# Altium project bgm111-breakout.PrjPcb
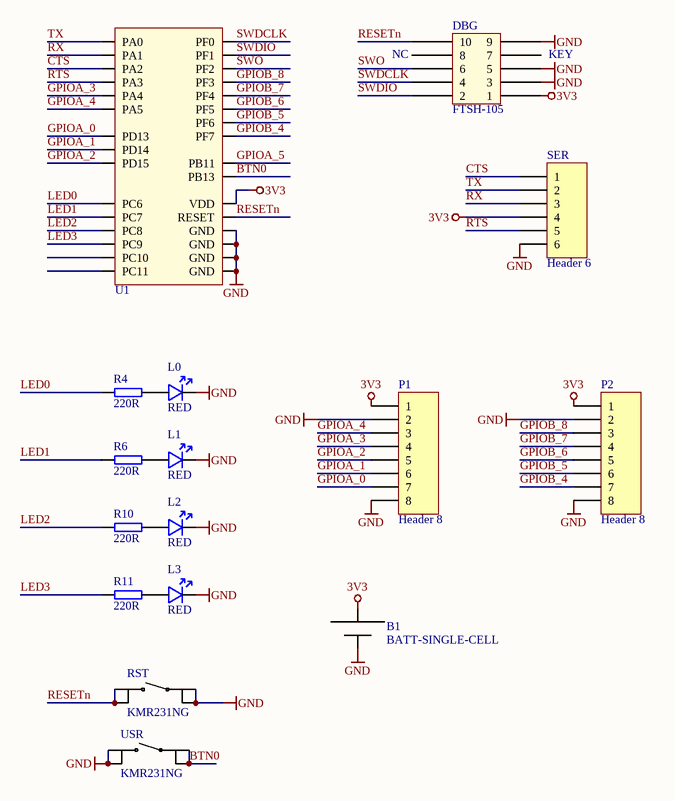
[diagram p0: bgm111-breakout.SchDoc]
1 sheet, 16 parts. Net scope: global (net labels, ports and power ports of the same name join across sheets).
Board file: bgm111-breakout.PcbDoc

## Sheet bgm111-breakout.SchDoc
size A

### Parts
B1  BATT-SINGLE-CELL  [3012]
DBG  FTSH-105  [FTSH-105-XX-X-DV-K]
L0  RED  [SMT0603P]
L1  RED  [SMT0603P]
L2  RED  [SMT0603P]
L3  RED  [SMT0603P]
P1  Header 8  [HDR1X8]
P2  Header 8  [HDR1X8]
R4  value 220R  [SMT0603]  (hidden comment: Resistor)
R6  value 220R  [SMT0603]  (hidden comment: Resistor)
R10  value 220R  [SMT0603]  (hidden comment: Resistor)
R11  value 220R  [SMT0603]  (hidden comment: Resistor)
RST  KMR231NG  [KMR231NG]
SER  Header 6  [HDR1X6]
U1  BGM111  [BGM111]  (value not drawn)
USR  KMR231NG  [KMR231NG]

### Nets
3V3: B1.1(+) DBG.1 P1.1 P2.1 SER.4 U1.29(VDD)
GND: B1.0(-) DBG.3 DBG.5 DBG.9 L0.2 L1.2 L2.2 L3.2 P1.2 P1.8 P2.2 P2.8 RST.3 RST.4 SER.6 U1.1(GND) U1.12(GND) U1.20(GND) U1.31(GND) USR.1 USR.2
BTN0: U1.13(PB13) USR.3 USR.4
CTS: SER.1 U1.7(PA2)
GPIOA_0: P1.7 U1.2(PD13)
GPIOA_1: P1.6 U1.3(PD14)
GPIOA_2: P1.5 U1.4(PD15)
GPIOA_3: P1.4 U1.9(PA4)
GPIOA_4: P1.3 U1.10(PA5)
GPIOA_5: U1.11(PB11)
GPIOB_4: P2.7 U1.28(PF7)
GPIOB_5: P2.6 U1.27(PF6)
GPIOB_6: P2.5 U1.26(PF5)
GPIOB_7: P2.4 U1.25(PF4)
GPIOB_8: P2.3 U1.24(PF3)
LED0: R4.2 U1.14(PC6)
LED1: R6.2 U1.15(PC7)
LED2: R10.2 U1.16(PC8)
LED3: R11.2 U1.17(PC9)
RESETn: DBG.10 RST.1 RST.2 U1.30(RESET)
RTS: SER.5 U1.8(PA3)
RX: SER.3 U1.6(PA1)
SWDCLK: DBG.4 U1.21(PF0)
SWDIO: DBG.2 U1.22(PF1)
SWO: DBG.6 U1.23(PF2)
TX: SER.2 U1.5(PA0)
NetL0_1: L0.1 R4.1
NetL1_1: L1.1 R6.1
NetL2_1: L2.1 R10.1
NetL3_1: L3.1 R11.1

Not connected (* = marked no-connect by the designer): DBG 7 8; U1 18(PC10) 19(PC11)

### Notes on the sheet
- (near DBG) NC
- (near DBG) KEY

### Library data of the parts
B1 = 3012: BATT HOLDER COIN 16MM SMT; Manufacturer: Keystone; Part Number: 3012
DBG = FTSH-105-01-X-DV-K: CONN HDR SM FTSH-105 10POS DUAL .05"; Supplier 1: Farnell; Supplier Part Number 1: 1667759; Supplier 2: Digi-Key; Supplier Part Number 2: FTSH-105-01-L-DV-K-ND
L0-L3 = LNJ237W82RA: LED SM 0603 RED 1V95 FWD VOLTAGE; Supplier 1: Digi-Key; Forward Voltage: 1V95; Supplier Part Number 1: LNJ237W82RACT-ND
P1 P2 = Header 8: Header, 8-Pin; LatestRevisionDate: 17-Jul-2002; LatestRevisionNote: Re-released for DXP Platform.; Publisher: Altium Limited
R4 R6 R10 R11 = RES-SM-0603-220R: RES SM 0603 220R; Supplier 1: Farnell; Supplier 2: Digi-Key; Supplier Part Number 1: 1127454; Supplier Part Number 2: 541-220HCT-ND
RST USR = KMR231NG: PB SW SM TOP; Supplier 1: Digi-Key; Supplier Part Number 1: CKN10246CT-ND
SER = Header 6: Header, 6-Pin; LatestRevisionDate: 17-Jul-2002; LatestRevisionNote: Re-released for DXP Platform.; Publisher: Altium Limited
U1 = BGM111: MODULE BLE BGM111